# EAGLE schematic Embedded_II_MAIN_BOARD (EAGLE 9.3.0)
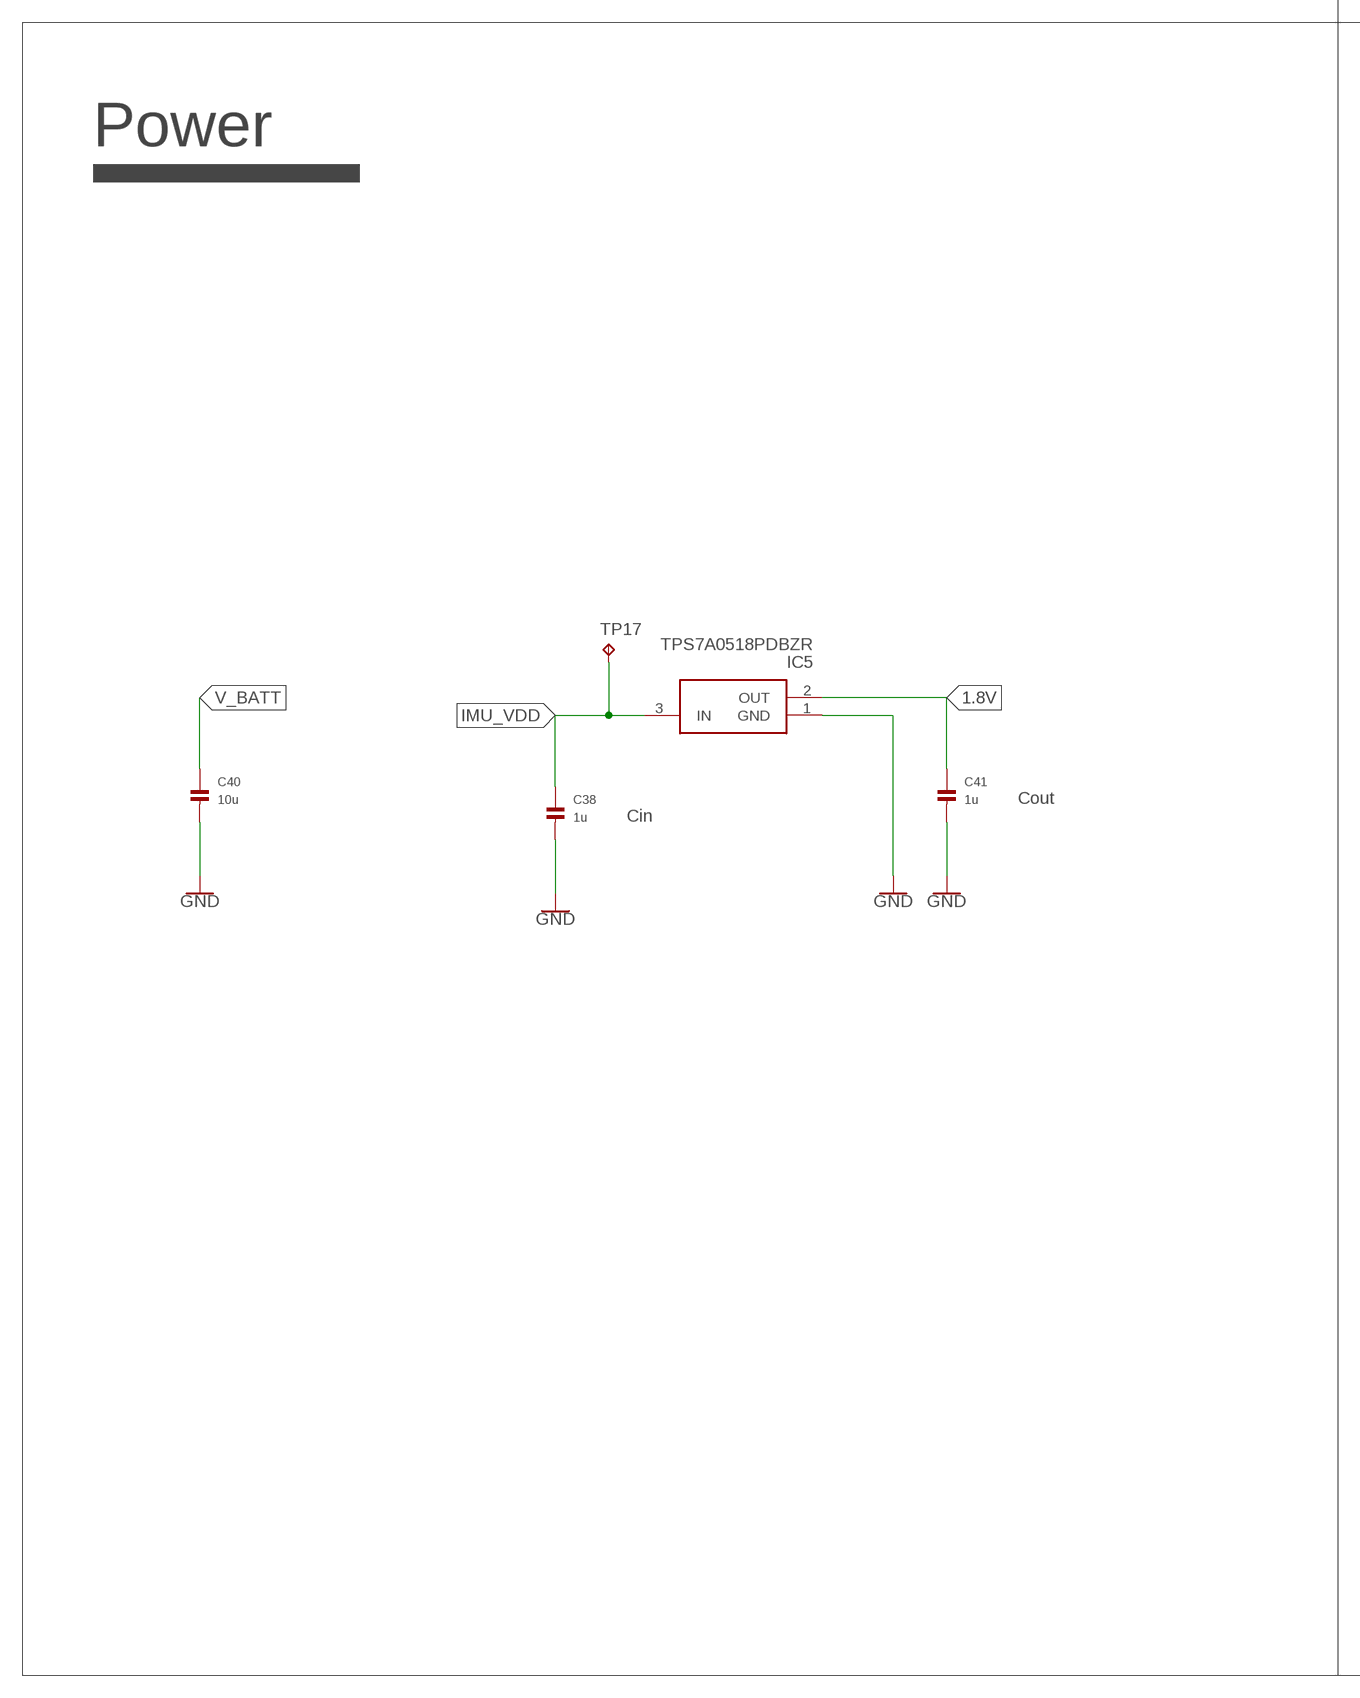
[diagram p0: schematic, sheet 1, part 1 of 2]
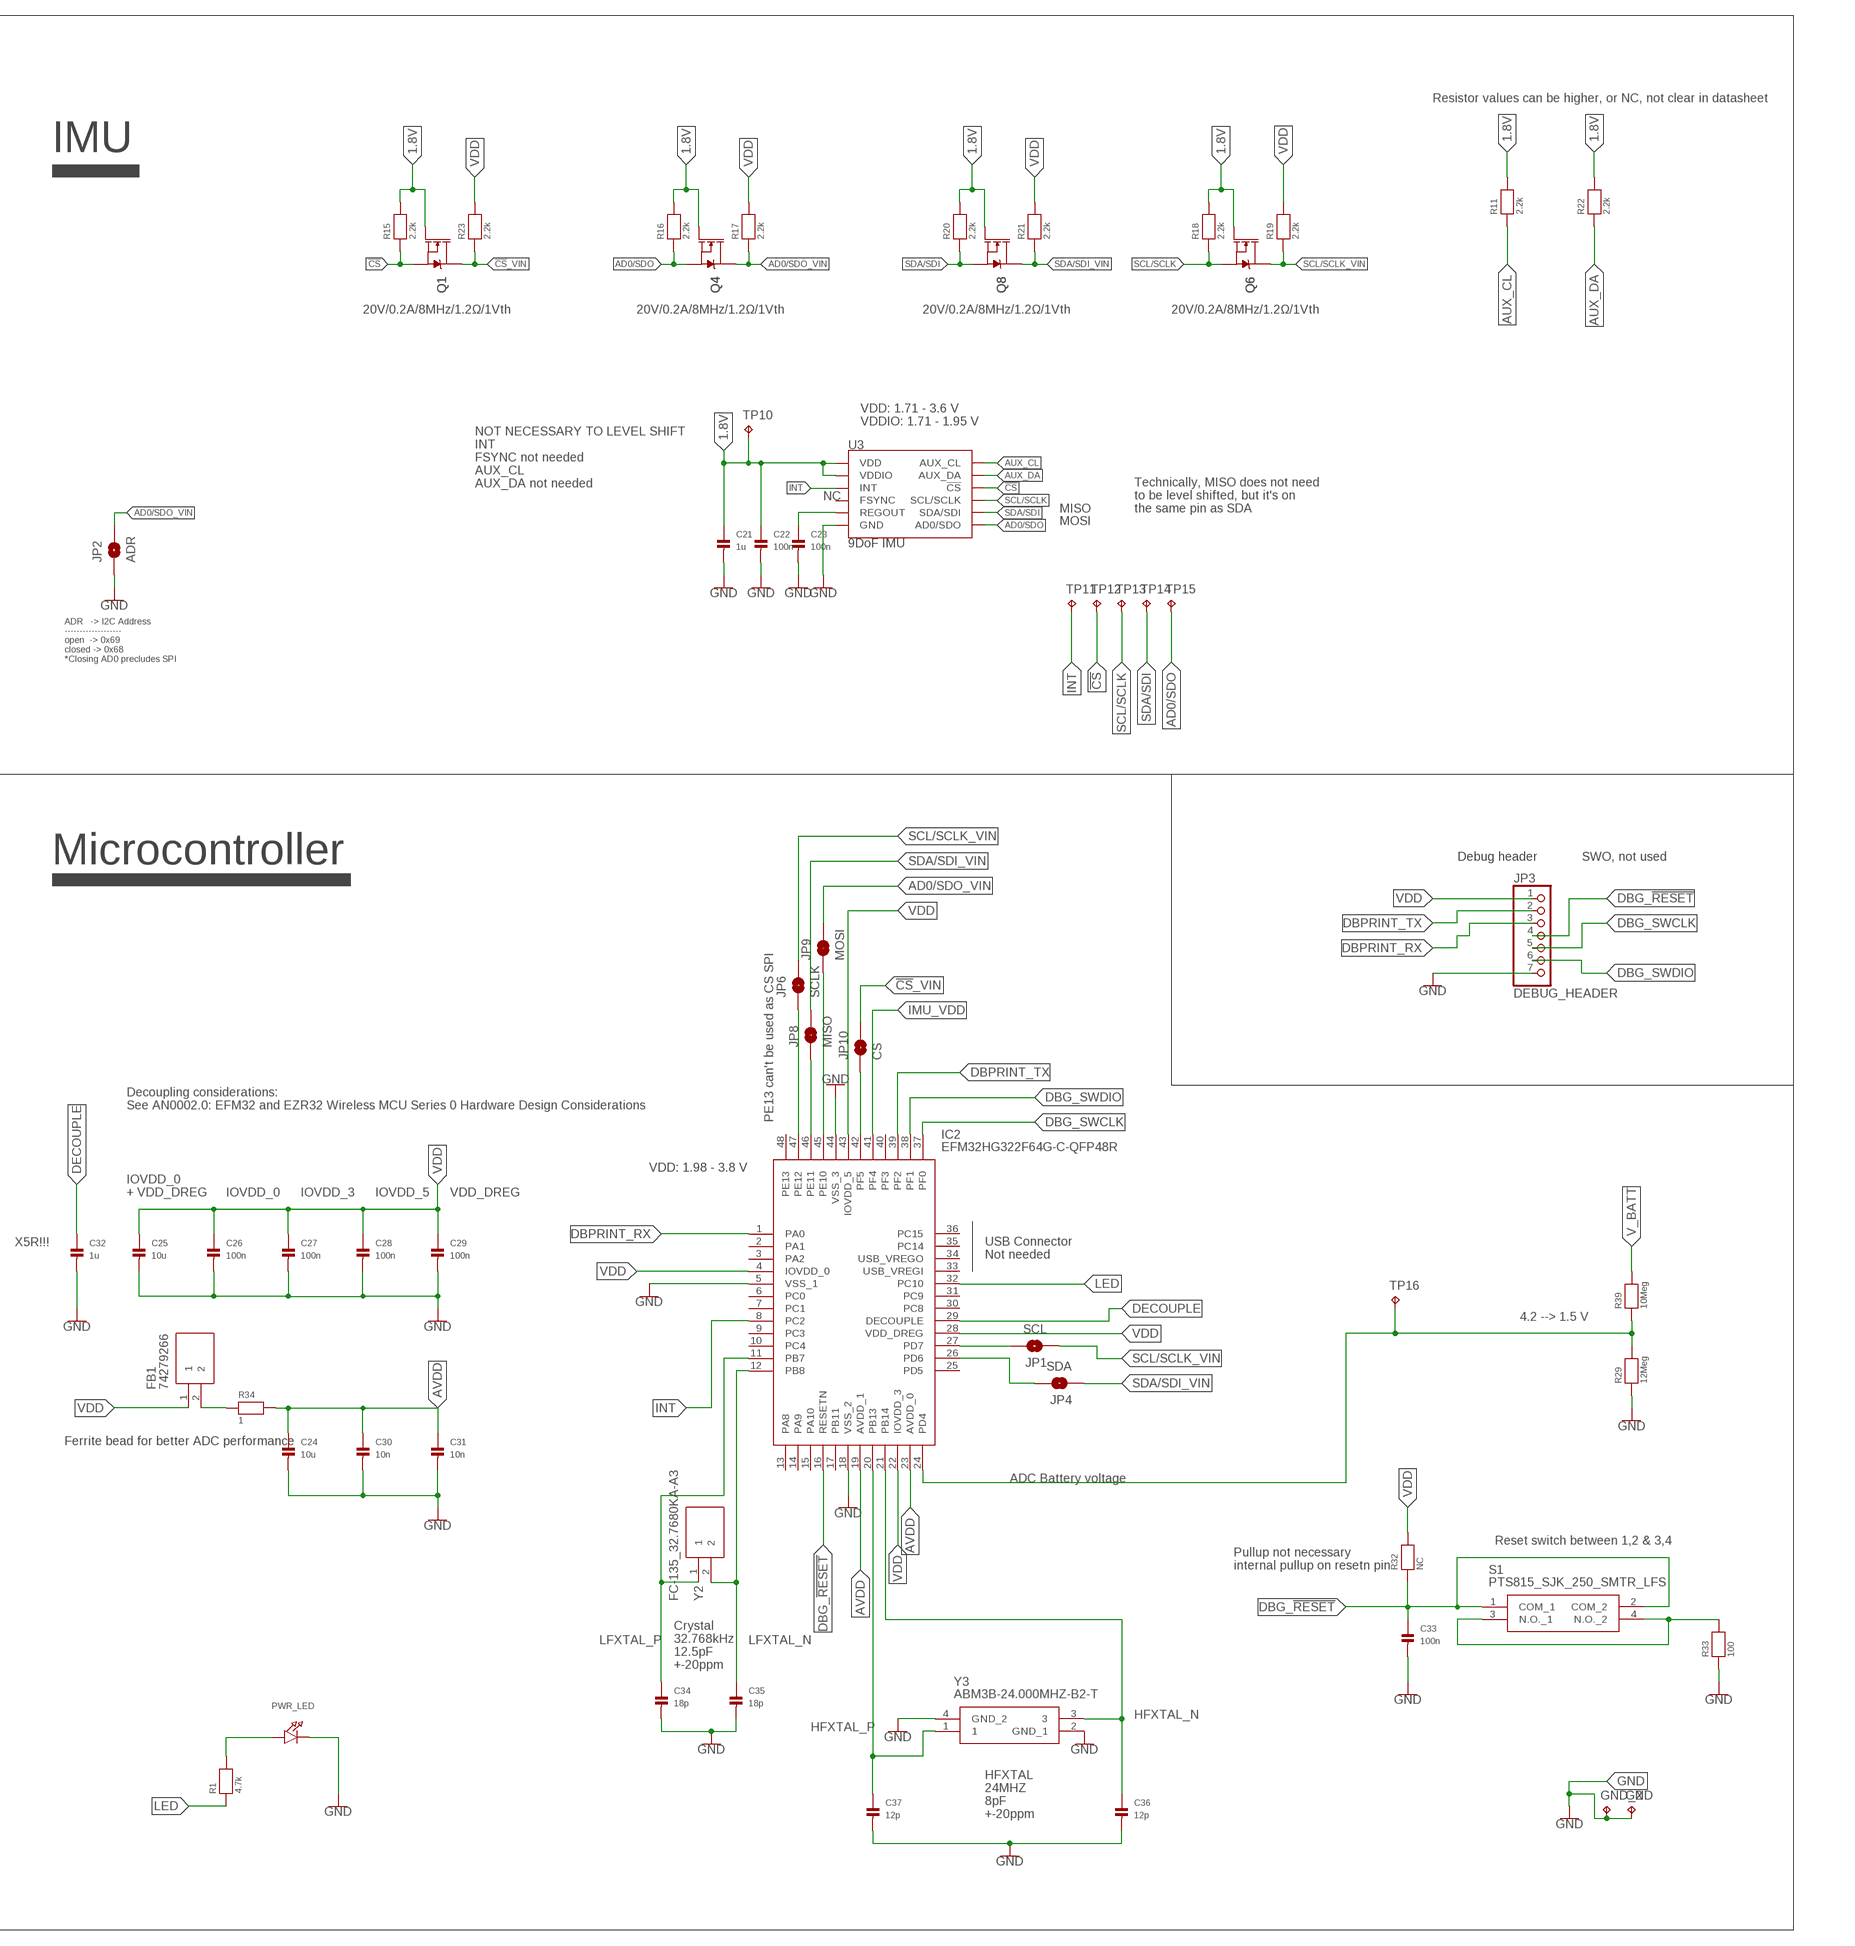
[diagram p1: schematic, sheet 1, part 2 of 2]

## Parts
C21  1u  CAP_CERAMIC0603  [0603]
C22  100n  CAP_CERAMIC0603  [0603]
C23  100n  CAP_CERAMIC0603  [0603]
C24  10u  CAP_CERAMIC0603  [0603]
C25  10u  CAP_CERAMIC0603  [0603]
C26  100n  CAP_CERAMIC0603  [0603]
C27  100n  CAP_CERAMIC0603  [0603]
C28  100n  CAP_CERAMIC0603  [0603]
C29  100n  CAP_CERAMIC0603  [0603]
C30  10n  CAP_CERAMIC0603  [0603]
C31  10n  CAP_CERAMIC0603  [0603]
C32  1u  CAP_CERAMIC0603  [0603]
C33  100n  CAP_CERAMIC0603  [0603]
C34  18p  CAP_CERAMIC0603  [0603]
C35  18p  CAP_CERAMIC0603  [0603]
C36  12p  CAP_CERAMIC0603  [0603]
C37  12p  CAP_CERAMIC0603  [0603]
C38  1u  CAP_CERAMIC0603  [0603]
C40  10u  CAP_CERAMIC0603  [0603]
C41  1u  CAP_CERAMIC0603  [0603]
FB1  74279266  [BEADC1608X100N]
GND  TPTP20SQ  [TP20SQ]
GND_2  TPTP20SQ  [TP20SQ]
IC2  EFM32HG322F64G-C-QFP48R  [QFP50P900X900X120-48N]
IC5  TPS7A0518PDBZR  [SOT95P237X112-3N]
JP1  SCL  JUMPER-SMT_2_NO_SILK  [SMT-JUMPER_2_NO_SILK]
JP2  ADR  JUMPER-SMT_2_NO_SILK  [SMT-JUMPER_2_NO_SILK]
JP3  DEBUG_HEADER  PINHD-1X7  [1X07]
JP4  SDA  JUMPER-SMT_2_NO_SILK  [SMT-JUMPER_2_NO_SILK]
JP6  SCLK  JUMPER-SMT_2_NC_TRACE_SILK  [SMT-JUMPER_2_NC_TRACE_SILK]
JP8  MISO  JUMPER-SMT_2_NC_TRACE_SILK  [SMT-JUMPER_2_NC_TRACE_SILK]
JP9  MOSI  JUMPER-SMT_2_NC_TRACE_SILK  [SMT-JUMPER_2_NC_TRACE_SILK]
JP10  CS  JUMPER-SMT_2_NC_TRACE_SILK  [SMT-JUMPER_2_NC_TRACE_SILK]
PWR_LED  LED0805  [CHIPLED_0805]
Q1  20V/0.2A/8MHz/1.2Ω/1Vth  MOSFET-NCH-RE1C002UN  [SOT-416FL]
Q4  20V/0.2A/8MHz/1.2Ω/1Vth  MOSFET-NCH-RE1C002UN  [SOT-416FL]
Q6  20V/0.2A/8MHz/1.2Ω/1Vth  MOSFET-NCH-RE1C002UN  [SOT-416FL]
Q8  20V/0.2A/8MHz/1.2Ω/1Vth  MOSFET-NCH-RE1C002UN  [SOT-416FL]
R1  4.7k  RESISTOR0603  [0603]
R11  2.2k  RESISTOR0603  [0603]
R15  2.2k  RESISTOR0603  [0603]
R16  2.2k  RESISTOR0603  [0603]
R17  2.2k  RESISTOR0603  [0603]
R18  2.2k  RESISTOR0603  [0603]
R19  2.2k  RESISTOR0603  [0603]
R20  2.2k  RESISTOR0603  [0603]
R21  2.2k  RESISTOR0603  [0603]
R22  2.2k  RESISTOR0603  [0603]
R23  2.2k  RESISTOR0603  [0603]
R29  12Meg  RESISTOR0603  [0603]
R32  NC  RESISTOR0603  [0603]
R33  100  RESISTOR0603  [0603]
R34  1  RESISTOR0603  [0603]
R39  10Meg  RESISTOR0603  [0603]
S1  PTS815_SJK_250_SMTR_LFS  [PTS815SJK250SMTRLFS]
TP10  TPTP10R  [TP10R]
TP11  TPTP10R  [TP10R]
TP12  TPTP10R  [TP10R]
TP13  TPTP10R  [TP10R]
TP14  TPTP10R  [TP10R]
TP15  TPTP10R  [TP10R]
TP16  TPTP10R  [TP10R]
TP17  TPTP10R  [TP10R]
U3  9DoF IMU  SPARKFUN-SENSORS_ICM-20948  [SPARKFUN-SENSORS_QFN24-3X3]
Y2  FC-135_32.7680KA-A3  [FC135327680KAAG0]
Y3  ABM3B-24.000MHZ-B2-T  [ABM3B8000MHZ101UT]

## Nets
1.8V: C21.1 C22.1 C41.1 IC5.2(OUT) Q1.1(G) Q4.1(G) Q6.1(G) Q8.1(G) R11.2 R15.2 R16.2 R18.2 R20.2 R22.2 TP10.TP U3.8(VDDIO) U3.13(VDD)
!CS: Q1.2(S) R15.1 TP12.TP U3.22(!CS)
!CS!_VIN: JP10.2 Q1.3(D) R23.1
AD0/SDO: Q4.2(S) R16.1 TP15.TP U3.9(AD0/SDO)
AD0/SDO_VIN: JP2.2 JP9.2 Q4.3(D) R17.1
AUX_CL: R11.1 U3.7(AUX_CL)
AUX_DA: R22.1 U3.21(AUX_DA)
AVDD: C24.1 C30.1 C31.1 IC2.19(AVDD_1) IC2.23(AVDD_0) R34.2
DBG_!RESET: C33.1 IC2.16(RESETN) JP3.4 R32.1 S1.1(COM_1) S1.2(COM_2)
DBG_SWCLK: IC2.37(PF0) JP3.5
DBG_SWDIO: IC2.38(PF1) JP3.6
DBPRINT_RX: IC2.1(PA0) JP3.3
DBPRINT_TX: IC2.39(PF2) JP3.2
DECOUPLE: C32.1 IC2.29(DECOUPLE)
GND: C21.2 C22.2 C23.2 C24.2 C25.2 C26.2 C27.2 C28.2 C29.2 C30.2 C31.2 C32.2 C33.2 C34.2 C35.2 C36.2 C37.2 C38.2 C40.2 C41.2 GND.TP GND_2.TP IC2.5(VSS_1) IC2.18(VSS_2) IC2.44(VSS_3) IC5.1(GND) JP2.1 JP3.7 PWR_LED.C R29.1 R33.1 U3.18(GND) U3.20(GND) Y3.2(GND_1) Y3.4(GND_2)
IMU_VDD: C38.1 IC2.41(PF4) IC5.3(IN) TP17.TP
INT: IC2.8(PC2) TP11.TP U3.12(INT)
LED: IC2.32(PC10) R1.1
N$1: IC2.27(PD7) JP1.2
N$3: PWR_LED.A R1.2
N$7: IC2.26(PD6) JP4.2
N$8: IC2.47(PE12) JP6.1
N$9: C35.1 IC2.12(PB8) Y2.2
N$10: C23.1 U3.10(REGOUT)
N$11: IC2.46(PE11) JP8.1
N$12: IC2.45(PE10) JP9.1
N$13: IC2.24(PD4) R29.2 R39.1 TP16.TP
N$14: C34.1 IC2.11(PB7) Y2.1
N$15: IC2.42(PF5) JP10.1
N$19: C37.1 IC2.20(PB13) Y3.1
N$20: C36.1 IC2.21(PB14) Y3.3
N$22: R33.2 S1.3(N.O._1) S1.4(N.O._2)
N$24: FB1.2 R34.1
SCL/SCLK: Q6.2(S) R18.1 TP13.TP U3.23(SCL/SCLK)
SCL/SCLK_VIN: JP1.1 JP6.2 Q6.3(D) R19.1
SDA/SDI: Q8.2(S) R20.1 TP14.TP U3.24(SDA/SDI)
SDA/SDI_VIN: JP4.1 JP8.2 Q8.3(D) R21.1
V_BATT: C40.1 R39.2
VDD: C25.1 C26.1 C27.1 C28.1 C29.1 FB1.1 IC2.4(IOVDD_0) IC2.22(IOVDD_3) IC2.28(VDD_DREG) IC2.43(IOVDD_5) JP3.1 R17.2 R19.2 R21.2 R23.2 R32.2
Unconnected: IC2.2(PA1) IC2.3(PA2) IC2.6(PC0) IC2.7(PC1) IC2.9(PC3) IC2.10(PC4) IC2.13(PA8) IC2.14(PA9) IC2.15(PA10) IC2.17(PB11) IC2.25(PD5) IC2.30(PC8) IC2.31(PC9) IC2.33(USB_VREGI) IC2.34(USB_VREGO) IC2.35(PC14) IC2.36(PC15) IC2.40(PF3) IC2.48(PE13) U3.11(FSYNC)

## Notes on the sheet
- Resistor values can be higher, or NC, not clear in datasheet
- IMU
- VDD: 1.71 - 3.6 V
  VDDIO: 1.71 - 1.95 V
- NOT NECESSARY TO LEVEL SHIFT
  INT
  FSYNC not needed
  AUX_CL
  AUX_DA not needed
- NC
- MISO
- Technically, MISO does not need 
  to be level shifted, but it's on 
  the same pin as SDA
- MOSI
- ADR   -> I2C Address
  -------------------
  open  -> 0x69
  closed -> 0x68
  *Closing AD0 precludes SPI
- Power | Microcontroller | Debug header | SWO, not used
- Decoupling considerations:
  See AN0002.0: EFM32 and EZR32 Wireless MCU Series 0 Hardware Design Considerations
- PE13 can't be used as CS SPI
- VDD: 1.98 - 3.8 V
- IOVDD_0
  + VDD_DREG
- IOVDD_0 | IOVDD_3 | IOVDD_5 | VDD_DREG
- X5R!!!
- USB Connector
  Not needed
- Cout | 4.2 --> 1.5 V
- Cin
- Ferrite bead for better ADC performance
- ADC Battery voltage
- Reset switch between 1,2 & 3,4
- Pullup not necessary
  internal pullup on resetn pin
- LFXTAL_P | LFXTAL_N
- Crystal
  32.768kHz
  12.5pF
  +-20ppm
- HFXTAL_N
- HFXTAL_P
- HFXTAL
  24MHZ
  8pF
  +-20ppm

## Library data of the parts
C21-C38 C40 C41 = microbuilder:CAP_CERAMIC: Ceramic Capacitors 0402 - 0402 Surface Mount Capacitors 16pF 50V 5% [Digikey: 445-4899-2-ND] 18pF 50V 5% [Digikey: 490-1281-2-ND] 22pF 50V 5% [Digikey: 490-1283-2-ND] 68pF 50V 5% [Digikey: 490-1289-2-ND] 0.1uF 10V 10% [Digikey: 490-1318-2-ND] 1.0uF 6.3V 10% [Digikey: 490-1320-2-ND] 0603 - 0603 Surface Mount Capacitors 16 pF 50V 5% [Digikey: 445-5051-2-ND] 22 pF 50V [Digikey: PCC220ACVTR-ND] 33 pF 50V 5% [Digikey: 490-1415-1-ND] 56pF 50V 5% [Digikey: 490-1421-1-ND] 220pF 50V 5% [Digikey: 445-1285-1-ND] 680 pF 50V 2200 pF 50V 5% C0G [Digikey: 445-1297-1-ND] 5600 pF 100V 5% X7R [Digikey: 478-3711-1-ND] 0.1 µF 25V 10% [Digikey: PCC2277TR-ND] 0.22 µF 16V 10% X7R [Digikey: 445-1318-1-ND] 1.0 µF 25V 10% [Digikey: 445-5146-2-ND] 0603 - RF Specific 3pF 250V +/-0.1pF RF [Digikey: 712-1347-1-ND] 18 pF 250V 5% [Digikey: 478-3505-1-ND or 712-1322-1-ND] 56 pF 250V 5% C0G RF [Digikey: 490-4867-1-ND] 68 pF 250V RF [Digikey: 490-4868-1-ND] 0805 - 0805 Surface Mount Capacitors 220 pF 250V 2% RF Ceramic Capacitor [Digikey: 712-1398-1-ND] 1000 pF 50V 2% NP0 Ceramic Capacitor [Digikey: 478-3760-1-ND] 0.1 µF 25V 10% Ceramic Capacitor [Digikey: PCC1828TR-ND] 1.0 µF 16V 10% Ceramic Capacitor[Digikey: 490-1691-2-ND] 10.0 µF 10V 10% Ceramic Capacitor[Digikey: 709-1228-1-ND] 10.0 uF 16V 10% Ceramic Capacitor [Digikey: 478-5165-2-ND] 47 uF 6.3V 20% Ceramic Capacitor [Digikey: 587-1779-1-ND or 399-5506-1-ND] 1206 - 1206 Surface Mount Capacitors 47uF 10V 20% Ceramic Capacitor [Digikey: 490-5528-1-ND or 399-5508-1-ND or 445-6010-1-ND] 100uF 6.3V -20%, +80% Y5V Ceramic Capacitor (Digikey: 490-4512-1-ND, Mouser: 81-GRM31CF50J107ZE1L)
FB1 = SamacSys_Parts:74279266: WE-CBF Ferrite Bead 0603 1000Ohm 200mA Wurth WE-CBF Series +/-25% Ferrite Multilayer SMD Inductor, 0603 Case, 200mA dc 600m Rdc Source: Datasheet <https://componentsearchengine.com/Datasheets/1/74279266.pdf>; DESCRIPTION: WE-CBF Ferrite Bead 0603 1000Ohm 200mA Wurth WE-CBF Series +/-25% Ferrite Multilayer SMD Inductor, 0603 Case, 200mA dc 600m Rdc; HEIGHT: 1mm; MANUFACTURER_NAME: Wurth Elektronik; MANUFACTURER_PART_NUMBER: 74279266; MOUSER_PART_NUMBER: 710-74279266; MOUSER_PRICE-STOCK: https://www.mouser.com/Search/Refine.aspx?Keyword=710-74279266
GND GND_2 TP10-TP17 = testpad:TP: Test pad
IC2 = SamacSys_Parts:EFM32HG322F64G-C-QFP48R: ARM Microcontrollers - MCU ARM Cortex -M0+ Happy Gecko Microcontroller IC 32-Bit 25MHz 64KB Flash QFN48 (7x7) Source: Datasheet <https://componentsearchengine.com/Datasheets/1/EFM32HG322F64G-C-QFP48R.pdf>; DESCRIPTION: ARM Microcontrollers - MCU ARM Cortex -M0+ Happy Gecko Microcontroller IC 32-Bit 25MHz 64KB Flash QFN48 (7x7); HEIGHT: 1.2mm; MANUFACTURER_NAME: Silicon Labs; MANUFACTURER_PART_NUMBER: EFM32HG322F64G-C-QFP48R; MOUSER_PART_NUMBER: 634-HG322F64GCQFP48R; MOUSER_PRICE-STOCK: https://www.mouser.com/Search/Refine.aspx?Keyword=634-HG322F64GCQFP48R
IC5 = SamacSys_Parts:TPS7A0518PDBZR: 1-A, ultra-low-IQ, 200-mA low-dropout (LDO) regulator in a small-sized package Source: Datasheet <https://www.ti.com/lit/gpn/TPS7A05>; DESCRIPTION: 1-A, ultra-low-IQ, 200-mA low-dropout (LDO) regulator in a small-sized package; HEIGHT: 1.12mm; MANUFACTURER_NAME: Texas Instruments; MANUFACTURER_PART_NUMBER: TPS7A0518PDBZR; MOUSER_PART_NUMBER: 595-TPS7A0518PDBZR; MOUSER_PRICE-STOCK: https://www.mouser.com/Search/Refine.aspx?Keyword=595-TPS7A0518PDBZR
JP1 JP2 JP4 = SparkFun-Jumpers:JUMPER-SMT_2_NO: Normally open jumper This jumper has two pads in close proximity to each other. Apply solder to close the connection. Round pads are easier to solder for beginners, but are a lot larger. SparkFun Product that uses the round pads: SparkFun EL Sequencer <https://www.sparkfun.com/products/12781>
JP3 = pinhead:PINHD-1X7: PIN HEADER
JP6 JP8-JP10 = SparkFun-Jumpers:JUMPER-SMT_2_NC_TRACE: Normally closed trace jumper This jumper has a trace between two pads so it's normally closed (NC). Use a razor knife to open the connection. For best results follow the IPC guidelines for cutting traces: Cutout at least 0.063 mm (0.005 in). Remove all loose material to clean up the cut area. Seal the cut with an approved epoxy. Reapply solder to reclose the connection.
PWR_LED = microbuilder:LED: LED 0603 - 0603 Surface Mount Package 2mA: Green LED - Low Power (3.9mcd, 2ma, 1.7Vf) - Digikey: 475-2709-2-ND Orange LED - Low Power (9.8mcd, 2ma, 1.8Vf) - Digikey: 475-1194-2-ND Red LED - Low Power (5mcd, 2ma, 1.8Vf) - Digikey: 475-1195-2-ND Yellow LED - Low Power (7mcd, 2ma, 1.8Vf) - Digikey: 475-1196-2-ND 5mA: Blue LED - Low Power (17mcd, 5ma, 2.9Vf) - Digikey: LNJ937W8CRACT-ND 0805 - 0805 Surface Mount Package 2mA: Red LED (8.8mcd, 2mA, 1.8Vf, Clear) - Low Power [Digikey: 475-2510-1-ND] Green LED (5mcd, 2mA, 1.8Vf, Clear) - Low Power [Digikey: 475-2730-1-ND] Yellow LED (11.3mcd, 2mA, 1.8Vf, Clear) - Low Power [Digikey: 475-2555-1-ND] 20mA: Red LED (104mcd, 20mA, Diffused) - LS R976 [Digikey: 475-1278-6-ND] Red LED (12mcd, 20mA, 2.0Vf, Clear) - APT2012EC [Digikey: 754-1128-1-ND] Green LED (15mcd, 20mA, 2.2Vf, Clear) - APT2012GC [Digikey: 754-1131-1-ND] Orange LED (160mcd, 20mA, 2.1Vf, Clear) - APT2012SECK [Digikey: 754-1130-1-ND] 1206 - 1206 Surface Mount Package Green LED (26mcd, 20mA, Diffused) - LG N971 [Digikey: 475-1407-6-ND] Red LED (15mcd, 20mA, Diffused) - LH N974 [Digikey: 475-1416-6-ND]
Q1 Q4 Q6 Q8 = SparkFun-DiscreteSemi:MOSFET-NCH: N-channel MOSFETs Voltage controlled devices that allow control of high current outputs. SparkFun Products: SparkFun OpenScale <https://www.sparkfun.com/products/13261> SparkFun Digital Sandbox <https://www.sparkfun.com/products/12651> SparkFun Monster Moto Shield <https://www.sparkfun.com/products/10182> SparkFun MOSFET Power Controller <https://www.sparkfun.com/products/11214>; PROD_ID: TRANS_14399
R1 R11 R15-R23 R29 R32-R34 R39 = microbuilder:RESISTOR: Resistors 0402 - 0402 Surface Mount Package 22 Ohm 1% 1/16W [Digikey: 311-22.0LRTR-ND] 33 Ohm 5% 1/16W 1.0K 5% 1/16W 1.5K 5% 1/16W 2.0K 1% 1/16W 10.0K 1% 1/16W [Digikey: 311-10.0KLRTR-ND] 10.0K 5% 1/16W [Digikey: RMCF0402JT10K0TR-ND] 12.1K 1% 1/16W [Digikey: 311-22.0LRTR-ND] 100.0K 5% 1/16W 0603 - 0603 Surface Mount Package 0 Ohm 1/10 Watt 1% Resistor 15 Ohm 1/10 Watt 1% Resistor 33 Ohm 1/10 Watt 1% Resistor 49.9 Ohm 1/10 Watt 1% Resistor 100 Ohm 1/10 Watt 1% Resistor 150 Ohm 1/10 Watt 1% Resistor 240 Ohm 1/10 Watt 1% Resistor 390 Ohm 1/10 Watt 1% Resistor 560 Ohm 1/10 Watt 1% Resistor 680 Ohm 1/10 Watt 1% Resistor 750 Ohm 1/10 Watt 1% Resistor 1.0K Ohm 1/10 Watt 1% Resistor 1.5K Ohm 1/10 Watt 1% Resistor 2.0K Ohm 1/10 Watt 1% Resistor 2.2K Ohm 1/10 Watt 1% Resistor 3.3K Ohm 1/10 Watt 1% Resistor 4.7K Ohm 1/10 Watt 1% Resistor 10.0K Ohm 1/10 Watt 1% Resistor 12.0K Ohm 1/10 Watt 1% Resistor 12.1K Ohm 1/10 Watt 1% Resistor 20.0K Ohm 1/10 Watt 1% Resistor 33.0K Ohm 1/10 Watt 1% Resistor 100.0K Ohm 1/10 Watt 1% Resistor 0805 - 0805 Surface Mount Package 0 Ohm 1/8 Watt 1% Resistor 33 Ohm 1/8 Watt 1% Resistor 100 Ohm 1/8 Watt 1% Resistor 150 Ohm 1/8 Watt 1% Resistor 200 Ohm 1/8 Watt 1% Resistor 240 Ohm 1/8 Watt 1% Resistor 330 Ohm 1/8 Watt 1% Resistor 390 Ohm 1/8 Watt 1% Resistor 470 Ohm 1/8 Watt 1% Resistor 1.0K Ohm 1/8 Watt 1% Resistor 1.5K Ohm 1/8 Watt 1% Resistor 2.0K Ohm 1/8 Watt 1% Resistor 4.7K Ohm 1/8 Watt 1% Resistor 5.1K Ohm 1/8 Watt 1% Resistor 5.6K Ohm 1/8 Watt 1% Resistor 10.0K Ohm 1/8 Watt 1% Resistor 22.0K Ohm 1/8 Watt 1% Resistor 33.0K Ohm 1/8 Watt 1% Resistor 100K Ohm 1/8 Watt 1% Resistor 1206 - 1206 Surface Mount Package 2012 - 2010 Surface Mount Package 0.11 Ohm 1/2 Watt 1% Resistor - Digikey: RHM.11UCT-ND
S1 = SamacSys_Parts:PTS815_SJK_250_SMTR_LFS: Tactile Switches Tact Switch, 12 VDC, 50 mA, 4.2x3.2, 2.5mm H, 250gf, J leads Source: Datasheet <https://componentsearchengine.com/Datasheets/1/PTS815 SJK 250 SMTR LFS.pdf>; DESCRIPTION: Tactile Switches Tact Switch, 12 VDC, 50 mA, 4.2x3.2, 2.5mm H, 250gf, J leads; HEIGHT: 2mm; MANUFACTURER_NAME: C & K COMPONENTS; MANUFACTURER_PART_NUMBER: PTS815 SJK 250 SMTR LFS; MOUSER_PART_NUMBER: 611-PTS815SJK250SMTR; MOUSER_PRICE-STOCK: https://www.mouser.com/Search/Refine.aspx?Keyword=611-PTS815SJK250SMTR
U3 = Wireless_IMU_v1.0:SPARKFUN-SENSORS_ICM-20948: ICM-20948 9 Degree of Freedom IMU World’s lowest power 9-axis MotionTracking device that is ideally suited for smartphones, tablets, wearable sensors, and IoT applications. Includes onboard Digital Motion Processor to offload computations from the host processor Datasheet <https://cdn.sparkfun.com/assets/learn_tutorials/5/5/0/MPU9250REV1.0.pdf> SparkFun Products: SparkFun IMU Breakout - ICM-20948 <https://www.sparkfun.com/products/15182>; PROD_ID: IC-14247
Y2 = SamacSys_Parts:FC-135_32.7680KA-A3: Crystals 32.768KHz 20ppm 12.5pF -40C -85C Source: Datasheet <https://componentsearchengine.com/Datasheets/1/FC-135 32.7680KA-A3.pdf>; DESCRIPTION: Crystals 32.768KHz 20ppm 12.5pF -40C -85C; HEIGHT: 0mm; MANUFACTURER_NAME: Epson Timing; MANUFACTURER_PART_NUMBER: FC-135 32.7680KA-A3; MOUSER_PART_NUMBER: 732-FC135-32.76KAA3; MOUSER_PRICE-STOCK: https://www.mouser.com/Search/Refine.aspx?Keyword=732-FC135-32.76KAA3
Y3 = SamacSys_Parts:ABM3B-24.000MHZ-B2-T: Abracon 24MHz Crystal +/-20ppm SMD 5 x 3 x 1.1mm Source: Datasheet <https://componentsearchengine.com/Datasheets/1/ABM3B-24.000MHZ-B2-T.pdf>; DESCRIPTION: Abracon 24MHz Crystal +/-20ppm SMD 5 x 3 x 1.1mm; HEIGHT: 1.1mm; MANUFACTURER_NAME: ABRACON; MANUFACTURER_PART_NUMBER: ABM3B-24.000MHZ-B2-T; MOUSER_PART_NUMBER: 815-ABM3B-24-B2; MOUSER_PRICE-STOCK: https://www.mouser.com/Search/Refine.aspx?Keyword=815-ABM3B-24-B2